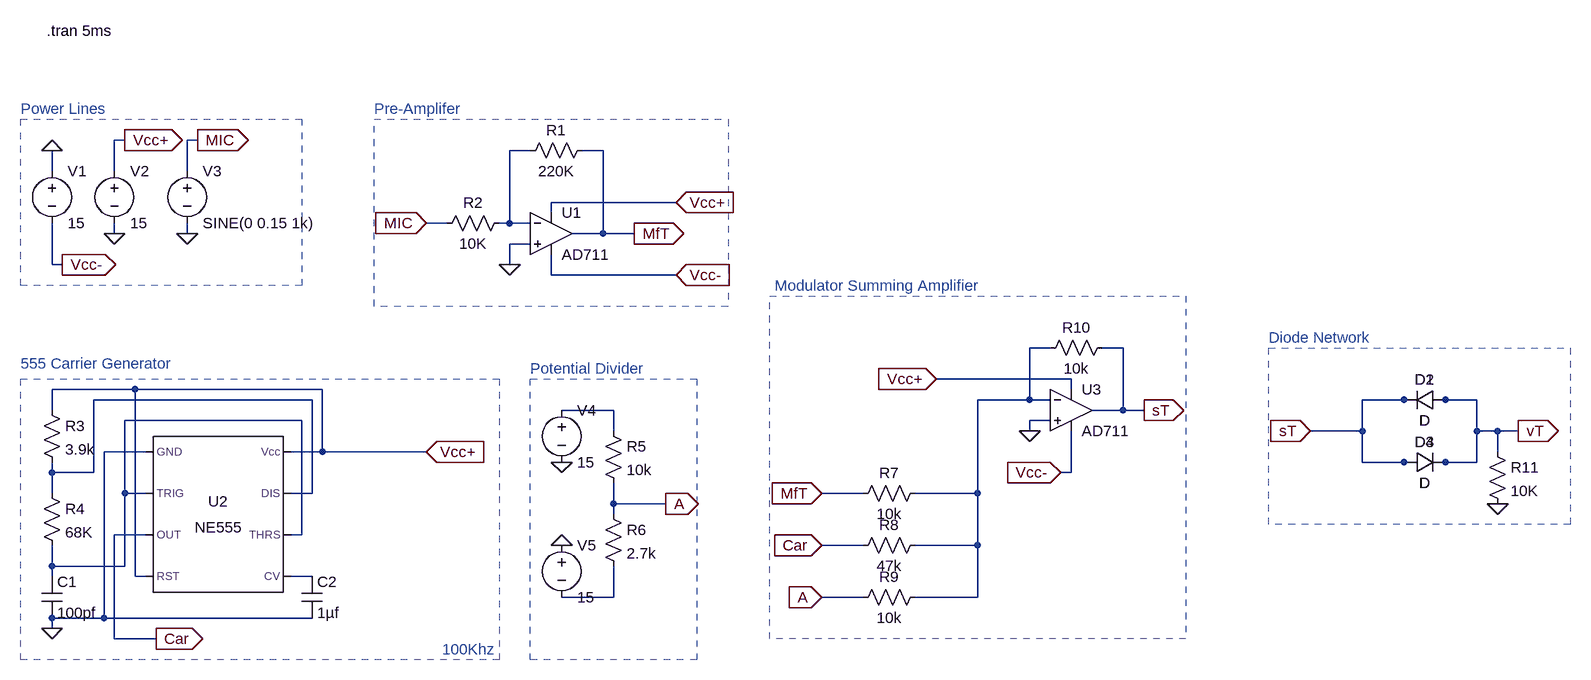
[diagram p0: schematic FINAL CW.asc]
FINAL CW.asc, the LTspice schematic file:
Version 4
SHEET 1 2596 1188
WIRE 64 16 48 16
WIRE 176 16 160 16
WIRE 688 32 656 32
WIRE 800 32 768 32
WIRE -48 64 -48 32
WIRE 48 64 48 16
WIRE 160 64 160 16
WIRE 912 112 720 112
WIRE 720 128 720 112
WIRE 560 144 528 144
WIRE 656 144 656 32
WIRE 656 144 640 144
WIRE 688 144 656 144
WIRE 48 160 48 144
WIRE 160 160 160 144
WIRE 800 160 800 32
WIRE 800 160 752 160
WIRE 848 160 800 160
WIRE 688 176 656 176
WIRE -48 208 -48 144
WIRE -32 208 -48 208
WIRE 656 208 656 176
WIRE 720 224 720 192
WIRE 912 224 720 224
WIRE 1488 336 1456 336
WIRE 1600 336 1568 336
WIRE 1520 384 1312 384
WIRE 80 400 -48 400
WIRE 368 400 80 400
WIRE 1520 400 1520 384
WIRE 352 416 16 416
WIRE 1456 416 1456 336
WIRE 1456 416 1376 416
WIRE 1488 416 1456 416
WIRE 2032 416 1968 416
WIRE 2144 416 2096 416
WIRE -48 432 -48 400
WIRE 816 432 736 432
WIRE 1600 432 1600 336
WIRE 1600 432 1552 432
WIRE 1632 432 1600 432
WIRE 336 448 64 448
WIRE 1488 448 1456 448
WIRE 816 464 816 432
WIRE 1456 464 1456 448
WIRE 1968 464 1968 416
WIRE 1968 464 1888 464
WIRE 2144 464 2144 416
WIRE 2176 464 2144 464
WIRE 2208 464 2176 464
WIRE 96 496 32 496
WIRE 368 496 368 400
WIRE 368 496 320 496
WIRE 528 496 368 496
WIRE 2176 496 2176 464
WIRE 1968 512 1968 464
WIRE 2032 512 1968 512
WIRE 2144 512 2144 464
WIRE 2144 512 2096 512
WIRE -48 528 -48 512
WIRE 16 528 16 416
WIRE 16 528 -48 528
WIRE 1520 528 1520 464
WIRE 1520 528 1504 528
WIRE -48 560 -48 528
WIRE 64 560 64 448
WIRE 96 560 64 560
WIRE 352 560 352 416
WIRE 352 560 320 560
WIRE 1200 560 1136 560
WIRE 1376 560 1376 416
WIRE 1376 560 1280 560
WIRE 816 576 816 544
WIRE 896 576 816 576
WIRE 816 592 816 576
WIRE 96 624 48 624
WIRE 336 624 336 448
WIRE 336 624 320 624
WIRE 1200 640 1136 640
WIRE 1376 640 1376 560
WIRE 1376 640 1280 640
WIRE -48 672 -48 640
WIRE 64 672 64 560
WIRE 64 672 -48 672
WIRE -48 688 -48 672
WIRE 80 688 80 400
WIRE 96 688 80 688
WIRE 352 688 320 688
WIRE 816 720 816 672
WIRE 816 720 736 720
WIRE 1200 720 1136 720
WIRE 1376 720 1376 640
WIRE 1376 720 1280 720
WIRE 32 752 32 496
WIRE 32 752 -48 752
WIRE 352 752 32 752
WIRE -48 768 -48 752
WIRE 48 784 48 624
WIRE 112 784 48 784
FLAG 160 160 0
FLAG 64 16 Vcc+
IOPIN 64 16 Out
FLAG 176 16 MIC
IOPIN 176 16 Out
FLAG 48 160 0
FLAG -48 32 0
FLAG -32 208 Vcc-
IOPIN -32 208 Out
FLAG 656 208 0
FLAG 528 144 MIC
IOPIN 528 144 In
FLAG 848 160 MfT
IOPIN 848 160 Out
FLAG 912 112 Vcc+
IOPIN 912 112 In
FLAG 912 224 Vcc-
IOPIN 912 224 In
FLAG 528 496 Vcc+
IOPIN 528 496 In
FLAG -48 768 0
FLAG 112 784 Car
IOPIN 112 784 Out
FLAG 896 576 A
IOPIN 896 576 Out
FLAG 736 512 0
FLAG 736 640 0
FLAG 1136 560 MfT
IOPIN 1136 560 In
FLAG 1136 640 Car
IOPIN 1136 640 In
FLAG 1136 720 A
IOPIN 1136 720 In
FLAG 1456 464 0
FLAG 1312 384 Vcc+
IOPIN 1312 384 In
FLAG 1504 528 Vcc-
IOPIN 1504 528 In
FLAG 1632 432 sT
IOPIN 1632 432 Out
FLAG 2176 576 0
FLAG 1888 464 sT
IOPIN 1888 464 In
FLAG 2208 464 vT
IOPIN 2208 464 Out
SYMBOL voltage 48 48 R0
WINDOW 123 0 0 Left 0
WINDOW 39 0 0 Left 0
SYMATTR InstName V2
SYMATTR Value 15
SYMBOL voltage 160 48 R0
WINDOW 123 0 0 Left 0
WINDOW 39 0 0 Left 0
SYMATTR InstName V3
SYMATTR Value SINE(0 0.15 1k)
SYMBOL voltage -48 48 R0
WINDOW 123 0 0 Left 0
WINDOW 39 0 0 Left 0
SYMATTR InstName V1
SYMATTR Value 15
SYMBOL res 784 16 R90
WINDOW 0 0 56 VBottom 2
WINDOW 3 32 56 VTop 2
SYMATTR InstName R1
SYMATTR Value 220K
SYMBOL OpAmps\\AD711 720 96 R0
SYMATTR InstName U1
SYMBOL res 656 128 R90
WINDOW 0 0 56 VBottom 2
WINDOW 3 32 56 VTop 2
SYMATTR InstName R2
SYMATTR Value 10K
SYMBOL Misc\\NE555 208 592 R0
SYMATTR InstName U2
SYMBOL res -64 416 R0
SYMATTR InstName R3
SYMATTR Value 3.9k
SYMBOL res -64 544 R0
SYMATTR InstName R4
SYMATTR Value 68K
SYMBOL cap -64 688 R0
SYMATTR InstName C1
SYMATTR Value 100pf
SYMBOL cap 336 688 R0
SYMATTR InstName C2
SYMATTR Value 1µf
SYMBOL res 800 448 R0
SYMATTR InstName R5
SYMATTR Value 10k
SYMBOL res 800 576 R0
SYMATTR InstName R6
SYMATTR Value 2.7k
SYMBOL voltage 736 416 R0
WINDOW 123 0 0 Left 0
WINDOW 39 0 0 Left 0
SYMATTR InstName V4
SYMATTR Value 15
SYMBOL voltage 736 624 R0
WINDOW 123 0 0 Left 0
WINDOW 39 0 0 Left 0
SYMATTR InstName V5
SYMATTR Value 15
SYMBOL res 1296 544 R90
WINDOW 0 0 56 VBottom 2
WINDOW 3 32 56 VTop 2
SYMATTR InstName R7
SYMATTR Value 10k
SYMBOL res 1296 624 R90
WINDOW 0 0 56 VBottom 2
WINDOW 3 32 56 VTop 2
SYMATTR InstName R8
SYMATTR Value 47k
SYMBOL res 1296 704 R90
WINDOW 0 0 56 VBottom 2
WINDOW 3 32 56 VTop 2
SYMATTR InstName R9
SYMATTR Value 10k
SYMBOL OpAmps\\AD711 1520 368 R0
SYMATTR InstName U3
SYMBOL res 1584 320 R90
WINDOW 0 0 56 VBottom 2
WINDOW 3 32 56 VTop 2
SYMATTR InstName R10
SYMATTR Value 10k
SYMBOL diode 2096 400 R90
WINDOW 0 0 32 VBottom 2
WINDOW 3 32 32 VTop 2
SYMATTR InstName D1
SYMBOL diode 2096 400 R90
WINDOW 0 0 32 VBottom 2
WINDOW 3 32 32 VTop 2
SYMATTR InstName D2
SYMBOL diode 2032 528 R270
WINDOW 0 32 32 VTop 2
WINDOW 3 0 32 VBottom 2
SYMATTR InstName D3
SYMBOL diode 2032 528 R270
WINDOW 0 32 32 VTop 2
WINDOW 3 0 32 VBottom 2
SYMATTR InstName D4
SYMBOL res 2160 480 R0
SYMATTR InstName R11
SYMATTR Value 10K
TEXT -56 -152 Left 2 !.tran 5ms
TEXT -96 -32 Left 2 ;Power Lines
TEXT 448 -32 Left 2 ;Pre-Amplifer
TEXT -96 360 Left 2 ;555 Carrier Generator
TEXT 552 800 Left 2 ;100Khz
TEXT 688 368 Left 2 ;Potential Divider
TEXT 1064 240 Left 2 ;Modulator Summing Amplifier
TEXT 1824 320 Left 2 ;Diode Network
RECTANGLE Normal 336 240 -96 -16 2
RECTANGLE Normal 992 272 448 -16 2
RECTANGLE Normal 640 816 -96 384 2
RECTANGLE Normal 944 816 688 384 2
RECTANGLE Normal 1696 784 1056 256 2
RECTANGLE Normal 2288 608 1824 336 2

The netlist it stands for:
* FINAL CW.asc
V2 Vcc+ 0 15
V3 MIC 0 SINE(0 0.15 1k)
V1 0 Vcc- 15
R1 MfT N001 220K
XU1 0 N001 Vcc+ Vcc- MfT AD712  ; AD711, pins In+ In- V+ V- OUT
R2 N001 MIC 10K
XU2 0 N005 Car Vcc+ N006 N005 N003 Vcc+ NE555  ; pins GND TRIG OUT RST CV THRS DIS Vcc
R3 Vcc+ N003 3.9k
R4 N003 N005 68K
C1 N005 0 100pf
C2 N006 0 1µf
R5 N004 A 10k
R6 A N007 2.7k
V4 N004 0 15
V5 0 N007 15
R7 N002 MfT 10k
R8 N002 Car 47k
R9 N002 A 10k
XU3 0 N002 Vcc+ Vcc- sT AD712  ; AD711, pins In+ In- V+ V- OUT
R10 sT N002 10k
D1 vT sT D
D2 vT sT D
D3 sT vT D
D4 sT vT D
R11 vT 0 10K
.model D D
.lib standard.dio
.tran 5ms
* Power Lines
* Pre-Amplifer
* 555 Carrier Generator
* 100Khz
* Potential Divider
* Modulator Summing Amplifier
* Diode Network
.lib ADI1.lib
.lib NE555.sub
.backanno
.end